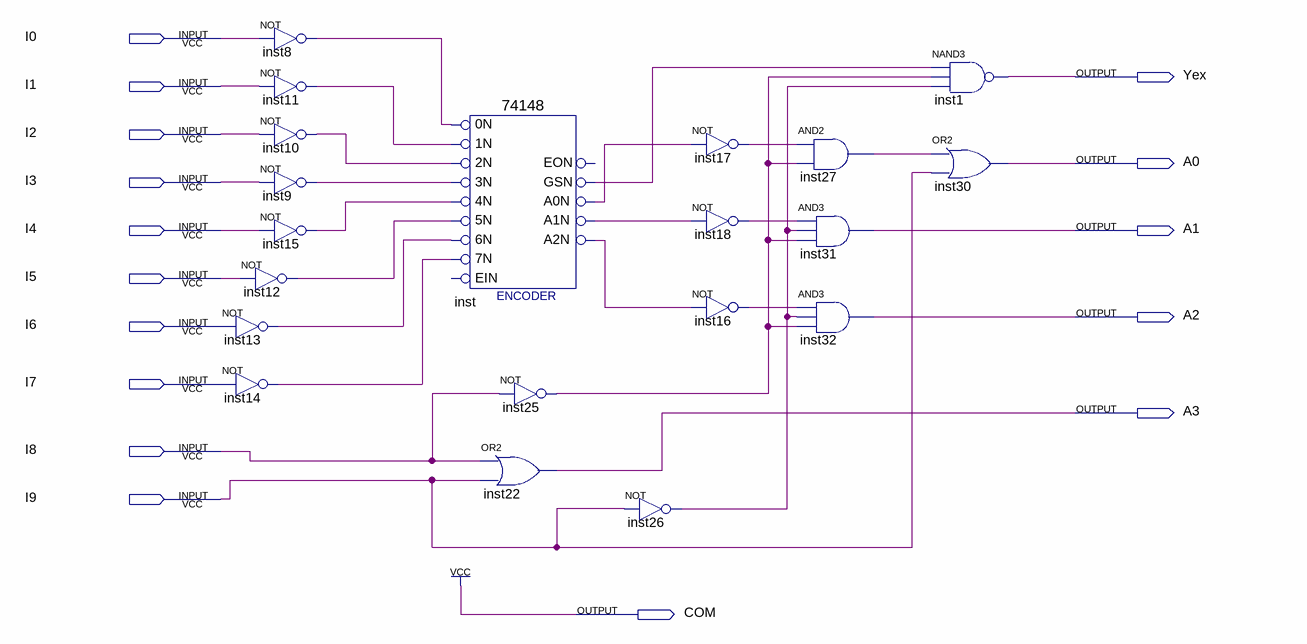
[diagram p0: schematic sheet]
// Quartus schematic bcd.bdf as structural Verilog: 20 symbols, 16 pins
module bcd (
  input  I0,
  input  I1,
  input  I2,
  input  I3,
  input  I4,
  input  I5,
  input  I6,
  input  I7,
  input  I8,
  input  I9,
  output Yex,
  output A0,
  output A1,
  output A2,
  output A3,
  output COM
);

  wire inst8_out, inst9_out, inst10_out, inst11_out, inst12_out, inst13_out, inst14_out, inst15_out,
       inst16_out, inst17_out, inst18_out, inst25_out, inst26_out, inst27_out, inst_a0n, inst_a1n, inst_a2n,
       inst_gsn;

  not inst8 (inst8_out, I0);
  not inst11 (inst11_out, I1);
  not inst10 (inst10_out, I2);
  not inst9 (inst9_out, I3);
  not inst15 (inst15_out, I4);
  not inst12 (inst12_out, I5);
  not inst13 (inst13_out, I6);
  not inst14 (inst14_out, I7);
  \74148  inst (
    .\5N (inst12_out), .\0N (inst8_out), .\1N (inst11_out), .\2N (inst10_out), .\3N (inst9_out),
    .\4N (inst15_out), .\6N (inst13_out), .\7N (inst14_out), .A1N(inst_a1n), .A0N(inst_a0n), .A2N(inst_a2n),
    .GSN(inst_gsn));  // open: EIN, EON
  not inst25 (inst25_out, I8);
  or inst22 (A3, I8, I9);
  not inst26 (inst26_out, I9);
  not inst17 (inst17_out, inst_a0n);
  not inst18 (inst18_out, inst_a1n);
  not inst16 (inst16_out, inst_a2n);
  and inst27 (inst27_out, inst17_out, inst25_out);
  and inst31 (A1, inst18_out, inst26_out, inst25_out);
  and inst32 (A2, inst16_out, inst26_out, inst25_out);
  nand inst1 (Yex, inst_gsn, inst25_out, inst26_out);
  or inst30 (A0, inst27_out, I9);

  assign COM = 1'b1;
endmodule
